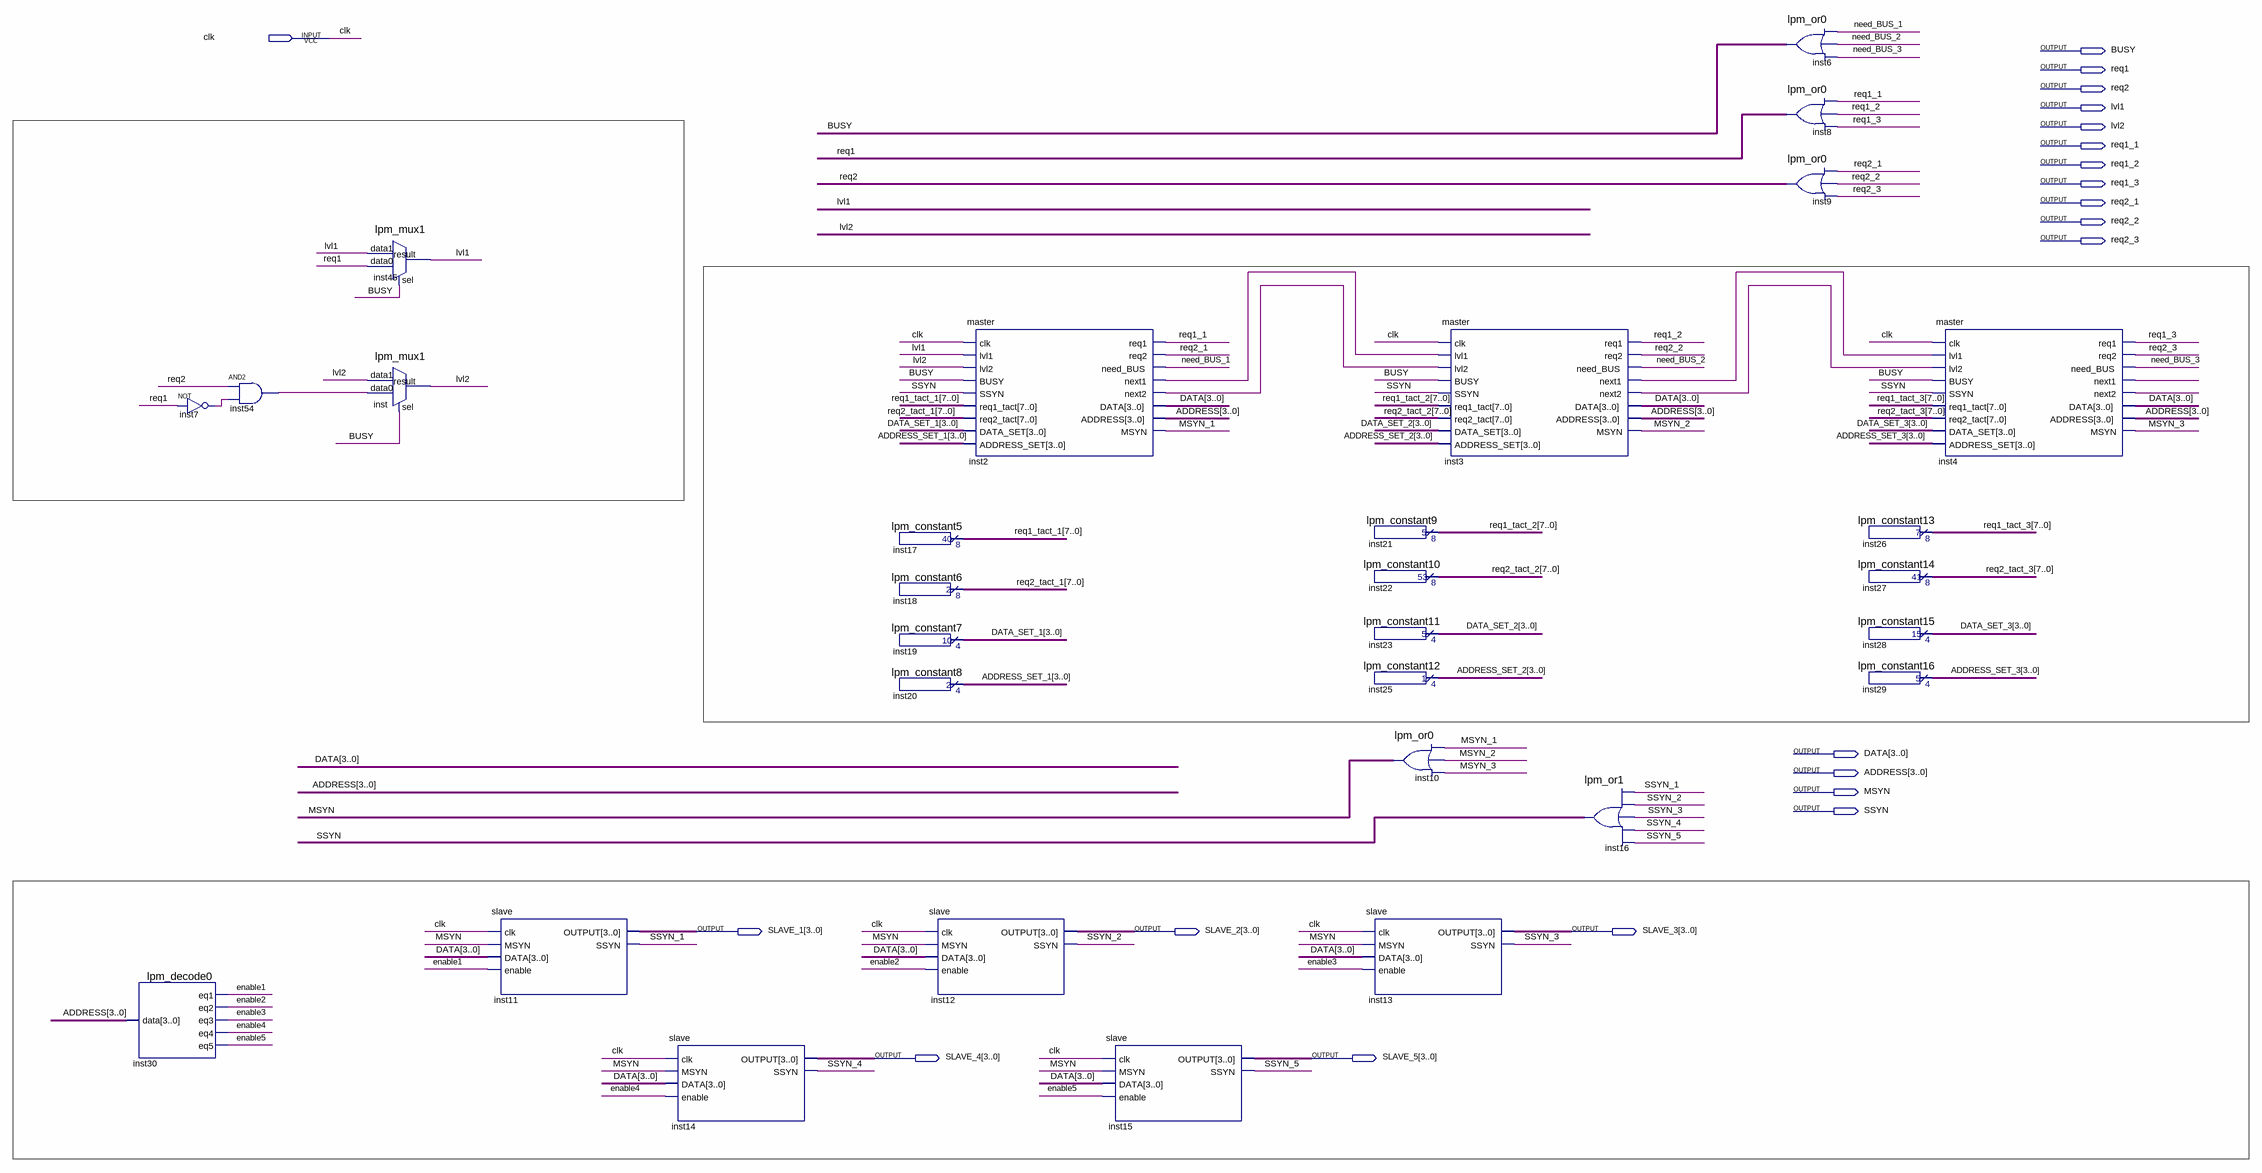
[diagram p0: schematic sheet]
// Quartus schematic result2.bdf as structural Verilog: 30 symbols, 21 pins
module result2 (
  input  clk,
  output BUSY,
  output req1,
  output req2,
  output lvl1,
  output lvl2,
  output req1_1,
  output req1_2,
  output req1_3,
  output req2_1,
  output req2_2,
  output req2_3,
  output [3:0] DATA,
  output [3:0] ADDRESS,
  output MSYN,
  output SSYN,
  output [3:0] SLAVE_1,
  output [3:0] SLAVE_2,
  output [3:0] SLAVE_3,
  output [3:0] SLAVE_4,
  output [3:0] SLAVE_5
);

  wire enable1, enable2, enable3, enable4, enable5, inst2_next1, inst2_next2, inst3_next1, inst3_next2,
       inst4_next1, inst4_next2, inst7_out, inst54_out, MSYN_1, MSYN_2, MSYN_3, need_BUS_1, need_BUS_2,
       need_BUS_3, SSYN_1, SSYN_2, SSYN_3, SSYN_4, SSYN_5;
  wire [3:0] ADDRESS_SET_1, ADDRESS_SET_2, ADDRESS_SET_3, DATA_SET_1, DATA_SET_2, DATA_SET_3;
  wire [7:0] req1_tact_1, req1_tact_2, req1_tact_3, req2_tact_1, req2_tact_2, req2_tact_3;

  lpm_decode0 inst30 (.data(ADDRESS), .eq1(enable1), .eq2(enable2), .eq3(enable3), .eq4(enable4), .eq5(enable5));
  not inst7 (inst7_out, req1);
  and inst54 (inst54_out, req2, inst7_out);
  lpm_mux1 inst45 (.data1(lvl1), .data0(req1), .sel(BUSY), .result(lvl1));
  lpm_mux1 inst (.data1(lvl2), .data0(inst54_out), .sel(BUSY), .result(lvl2));
  slave inst11 (.clk(clk), .MSYN(MSYN), .DATA(DATA), .enable(enable1), .OUTPUT(SLAVE_1), .SSYN(SSYN_1));
  slave inst14 (.clk(clk), .MSYN(MSYN), .DATA(DATA), .enable(enable4), .OUTPUT(SLAVE_4), .SSYN(SSYN_4));
  lpm_constant5 inst17 (.result(req1_tact_1));
  lpm_constant6 inst18 (.result(req2_tact_1));
  lpm_constant7 inst19 (.result(DATA_SET_1));
  lpm_constant8 inst20 (.result(ADDRESS_SET_1));
  slave inst12 (.clk(clk), .MSYN(MSYN), .DATA(DATA), .enable(enable2), .OUTPUT(SLAVE_2), .SSYN(SSYN_2));
  master inst2 (
    .clk(clk), .lvl1(lvl1), .lvl2(lvl2), .BUSY(BUSY), .SSYN(SSYN), .req1_tact(req1_tact_1),
    .req2_tact(req2_tact_1), .DATA_SET(DATA_SET_1), .ADDRESS_SET(ADDRESS_SET_1), .req1(req1_1),
    .req2(req2_1), .need_BUS(need_BUS_1), .next1(inst2_next1), .next2(inst2_next2), .DATA(DATA),
    .ADDRESS(ADDRESS), .MSYN(MSYN_1));
  slave inst15 (.clk(clk), .MSYN(MSYN), .DATA(DATA), .enable(enable5), .OUTPUT(SLAVE_5), .SSYN(SSYN_5));
  lpm_constant9 inst21 (.result(req1_tact_2));
  lpm_constant10 inst22 (.result(req2_tact_2));
  lpm_constant11 inst23 (.result(DATA_SET_2));
  lpm_constant12 inst25 (.result(ADDRESS_SET_2));
  lpm_or0 inst10 (.data0(MSYN_1), .data1(MSYN_2), .data2(MSYN_3), .result(MSYN));
  slave inst13 (.clk(clk), .MSYN(MSYN), .DATA(DATA), .enable(enable3), .OUTPUT(SLAVE_3), .SSYN(SSYN_3));
  master inst3 (
    .clk(clk), .lvl1(inst2_next1), .lvl2(inst2_next2), .BUSY(BUSY), .SSYN(SSYN), .req1_tact(req1_tact_2),
    .req2_tact(req2_tact_2), .DATA_SET(DATA_SET_2), .ADDRESS_SET(ADDRESS_SET_2), .req1(req1_2),
    .req2(req2_2), .need_BUS(need_BUS_2), .next1(inst3_next1), .next2(inst3_next2), .DATA(DATA),
    .ADDRESS(ADDRESS), .MSYN(MSYN_2));
  lpm_or1 inst16 (.data0(SSYN_1), .data1(SSYN_2), .data2(SSYN_3), .data3(SSYN_4), .data4(SSYN_5), .result(SSYN));
  lpm_or0 inst6 (.data0(need_BUS_1), .data1(need_BUS_2), .data2(need_BUS_3), .result(BUSY));
  lpm_or0 inst8 (.data0(req1_1), .data1(req1_2), .data2(req1_3), .result(req1));
  lpm_or0 inst9 (.data0(req2_1), .data1(req2_2), .data2(req2_3), .result(req2));
  lpm_constant13 inst26 (.result(req1_tact_3));
  lpm_constant14 inst27 (.result(req2_tact_3));
  lpm_constant15 inst28 (.result(DATA_SET_3));
  lpm_constant16 inst29 (.result(ADDRESS_SET_3));
  master inst4 (
    .clk(clk), .lvl1(inst3_next1), .lvl2(inst3_next2), .BUSY(BUSY), .SSYN(SSYN), .req1_tact(req1_tact_3),
    .req2_tact(req2_tact_3), .DATA_SET(DATA_SET_3), .ADDRESS_SET(ADDRESS_SET_3), .req1(req1_3),
    .req2(req2_3), .need_BUS(need_BUS_3), .next1(inst4_next1), .next2(inst4_next2), .DATA(DATA),
    .ADDRESS(ADDRESS), .MSYN(MSYN_3));
endmodule
